# Altium schematic sheet Top Level.SchDoc
size A
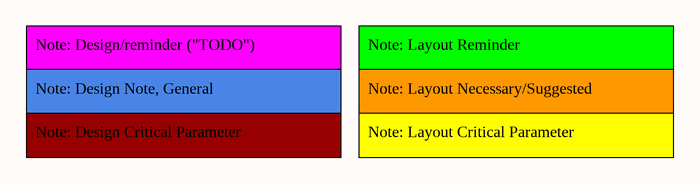
[diagram p0: Top Level.SchDoc]

## Notes on the sheet
- Note: Design/reminder ("TODO")
- Note: Design Note, General
- Note: Layout Reminder
- Note: Layout Necessary/Suggested
- Note: Design Critical Parameter
- Note: Layout Critical Parameter